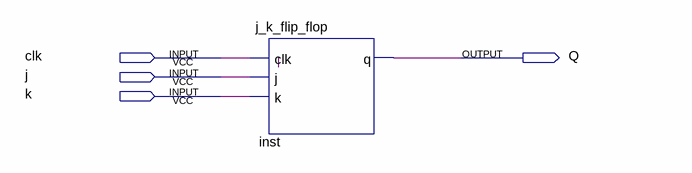
[diagram p0: schematic sheet]
// Quartus schematic first_test.bdf as structural Verilog: 1 symbols, 4 pins
module first_test (
  input  clk,
  input  j,
  input  k,
  output Q
);

  j_k_flip_flop inst (.clk(clk), .j(j), .k(k), .q(Q));
endmodule
